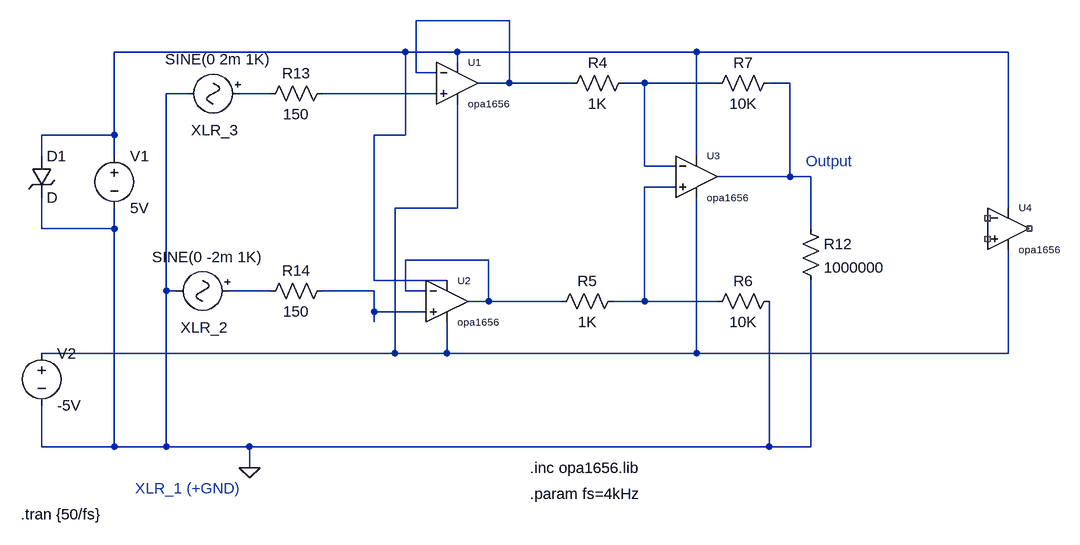
[diagram p0: schematic PreAmpV2.asc]
PreAmpV2.asc, the LTspice schematic file:
Version 4.1
SHEET 1 2164 4756
WIRE 288 -1968 144 -1968
WIRE 128 -1920 -320 -1920
WIRE 208 -1920 128 -1920
WIRE 576 -1920 208 -1920
WIRE 1056 -1920 576 -1920
WIRE 208 -1904 208 -1920
WIRE 144 -1888 144 -1968
WIRE 176 -1888 144 -1888
WIRE 288 -1872 288 -1968
WIRE 288 -1872 240 -1872
WIRE 384 -1872 288 -1872
WIRE 496 -1872 464 -1872
WIRE 608 -1872 496 -1872
WIRE 720 -1872 688 -1872
WIRE -208 -1856 -240 -1856
WIRE -80 -1856 -128 -1856
WIRE 176 -1856 0 -1856
WIRE -320 -1792 -320 -1920
WIRE -320 -1792 -432 -1792
WIRE 128 -1792 128 -1920
WIRE 128 -1792 80 -1792
WIRE -432 -1760 -432 -1792
WIRE -320 -1760 -320 -1792
WIRE 576 -1760 576 -1920
WIRE 496 -1744 496 -1872
WIRE 544 -1744 496 -1744
WIRE 720 -1728 720 -1872
WIRE 720 -1728 608 -1728
WIRE 752 -1728 720 -1728
WIRE 544 -1712 496 -1712
WIRE 208 -1680 208 -1840
WIRE 208 -1680 112 -1680
WIRE 1056 -1680 1056 -1920
WIRE -432 -1648 -432 -1696
WIRE -320 -1648 -320 -1680
WIRE -320 -1648 -432 -1648
WIRE 752 -1648 752 -1728
WIRE 256 -1600 128 -1600
WIRE 80 -1568 80 -1792
WIRE 192 -1568 80 -1568
WIRE -240 -1552 -240 -1856
WIRE -224 -1552 -240 -1552
WIRE -80 -1552 -144 -1552
WIRE 80 -1552 0 -1552
WIRE 128 -1552 128 -1600
WIRE 160 -1552 128 -1552
WIRE 256 -1536 256 -1600
WIRE 256 -1536 224 -1536
WIRE 368 -1536 256 -1536
WIRE 496 -1536 496 -1712
WIRE 496 -1536 448 -1536
WIRE 608 -1536 496 -1536
WIRE 80 -1520 80 -1552
WIRE 160 -1520 80 -1520
WIRE 80 -1504 80 -1520
WIRE 112 -1456 112 -1680
WIRE 112 -1456 -432 -1456
WIRE 192 -1456 192 -1504
WIRE 192 -1456 112 -1456
WIRE 576 -1456 576 -1696
WIRE 576 -1456 192 -1456
WIRE 1056 -1456 1056 -1616
WIRE 1056 -1456 576 -1456
WIRE -432 -1312 -432 -1376
WIRE -320 -1312 -320 -1648
WIRE -320 -1312 -432 -1312
WIRE -240 -1312 -240 -1552
WIRE -240 -1312 -320 -1312
WIRE -112 -1312 -240 -1312
WIRE 688 -1312 688 -1536
WIRE 688 -1312 -112 -1312
WIRE 752 -1312 752 -1568
WIRE 752 -1312 688 -1312
WIRE -112 -1280 -112 -1312
FLAG -112 -1280 0
SYMBOL OpAmps\\opamp2 208 -1936 R0
WINDOW 0 16 32 Left 1
WINDOW 3 16 96 Left 1
SYMATTR InstName U1
SYMATTR Value opa1656
SYMBOL Misc\\signal -112 -1856 R90
WINDOW 0 41 53 VTop 2
WINDOW 3 -37 49 VBottom 2
WINDOW 123 0 0 Left 0
WINDOW 39 0 0 Left 0
SYMATTR InstName XLR_3
SYMATTR Value SINE(0 2m 1K)
SYMBOL voltage -320 -1776 R0
WINDOW 123 0 0 Left 0
WINDOW 39 0 0 Left 0
SYMATTR InstName V1
SYMATTR Value 5V
SYMBOL res 16 -1872 R90
WINDOW 0 0 56 VBottom 2
WINDOW 3 32 56 VTop 2
SYMATTR InstName R13
SYMATTR Value 150
SYMBOL res 16 -1568 R90
WINDOW 0 0 56 VBottom 2
WINDOW 3 32 56 VTop 2
SYMATTR InstName R14
SYMATTR Value 150
SYMBOL res 736 -1664 R0
SYMATTR InstName R12
SYMATTR Value 1000000
SYMBOL Misc\\signal -128 -1552 R90
WINDOW 0 41 53 VTop 2
WINDOW 3 -37 49 VBottom 2
WINDOW 123 0 0 Left 0
WINDOW 39 0 0 Left 0
SYMATTR InstName XLR_2
SYMATTR Value SINE(0 -2m 1K)
SYMBOL TVSdiode -448 -1760 R0
SYMATTR InstName D1
SYMBOL voltage -432 -1472 R0
WINDOW 123 0 0 Left 0
WINDOW 39 0 0 Left 0
SYMATTR InstName V2
SYMATTR Value -5V
SYMBOL OpAmps\\opamp2 192 -1600 R0
WINDOW 0 16 32 Left 1
WINDOW 3 16 96 Left 1
SYMATTR InstName U2
SYMATTR Value opa1656
SYMBOL res 480 -1888 R90
WINDOW 0 0 56 VBottom 2
WINDOW 3 32 56 VTop 2
SYMATTR InstName R4
SYMATTR Value 1K
SYMBOL res 464 -1552 R90
WINDOW 0 0 56 VBottom 2
WINDOW 3 32 56 VTop 2
SYMATTR InstName R5
SYMATTR Value 1K
SYMBOL OpAmps\\opamp2 576 -1792 R0
WINDOW 0 16 32 Left 1
WINDOW 3 16 96 Left 1
SYMATTR InstName U3
SYMATTR Value opa1656
SYMBOL res 704 -1552 R90
WINDOW 0 0 56 VBottom 2
WINDOW 3 32 56 VTop 2
SYMATTR InstName R6
SYMATTR Value 10K
SYMBOL res 704 -1888 R90
WINDOW 0 0 56 VBottom 2
WINDOW 3 32 56 VTop 2
SYMATTR InstName R7
SYMATTR Value 10K
SYMBOL OpAmps\\opamp2 1056 -1712 R0
WINDOW 0 16 32 Left 1
WINDOW 3 16 96 Left 1
SYMATTR InstName U4
SYMATTR Value opa1656
TEXT -288 -1248 Left 2 ;XLR_1 (+GND)
TEXT 744 -1752 Left 2 ;Output
TEXT 320 -1280 Left 2 !.inc opa1656.lib
TEXT 320 -1240 Left 2 !.param fs=4kHz
TEXT -464 -1208 Left 2 !.tran {50/fs}

The netlist it stands for:
* PreAmpV2.asc
X§U1 N006 N001 N002 N008 N001 opa1656  ; pins In+ In- V+ V- OUT
V§XLR_3 N005 0 SINE(0 2m 1K)
V1 N002 0 5V
R13 N006 N005 150
R14 N011 N010 150
R12 N004 0 1000000
V§XLR_2 N010 0 SINE(0 -2m 1K)
D1 N002 0 D
V2 N008 0 -5V
X§U2 N011 N009 N002 N008 N009 opa1656  ; pins In+ In- V+ V- OUT
R4 N003 N001 1K
R5 N007 N009 1K
X§U3 N007 N003 N002 N008 N004 opa1656  ; pins In+ In- V+ V- OUT
R6 0 N007 10K
R7 N004 N003 10K
X§U4 NC_01 NC_02 N002 N008 NC_03 opa1656  ; pins In+ In- V+ V- OUT
.model D D
.lib standard.dio
* XLR_1 (+GND)
* Output
.inc opa1656.lib
.param fs=4kHz
.tran {50/fs}
.backanno
.end